# EAGLE schematic Great_Stroya (EAGLE 9.5.2)
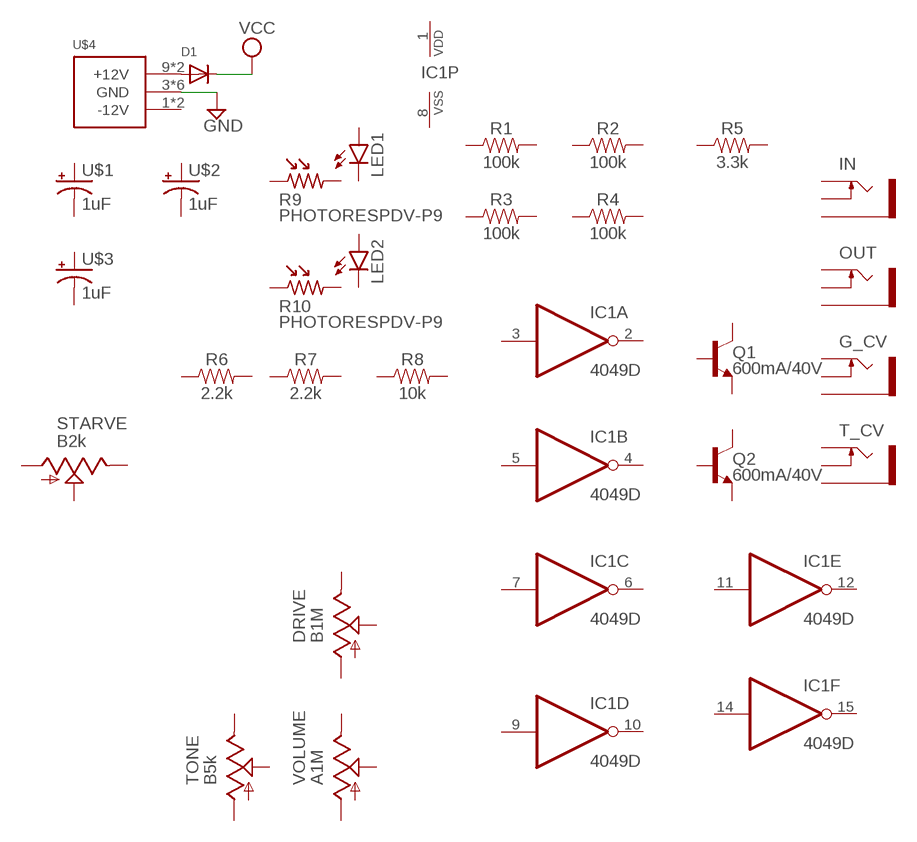
[diagram p0: schematic, sheet 1]

## Parts
D1  DIODESOD-123  [SOD-123]
DRIVE  B1M  9MM_SNAP-IN_POT_  [9MM_SNAP-IN_POT]
G_CV  THONKICONNNEW  [WQP-PJ301M-12_JACK]
IC1  4049D  [SO16]
IN  THONKICONNNEW  [WQP-PJ301M-12_JACK]
LED1  LED3MM  [LED3MM]
LED2  LED3MM  [LED3MM]
OUT  THONKICONNNEW  [WQP-PJ301M-12_JACK]
Q1  600mA/40V  TRANS_NPN-MMBT2222AL  [SOT23-3]
Q2  600mA/40V  TRANS_NPN-MMBT2222AL  [SOT23-3]
R1  100k  100KOHM-0603-1/10W-1%  [0603]
R2  100k  100KOHM-0603-1/10W-1%  [0603]
R3  100k  100KOHM-0603-1/10W-1%  [0603]
R4  100k  100KOHM-0603-1/10W-1%  [0603]
R5  3.3k  3.3KOHM-0603-1/10W-1%  [0603]
R6  2.2k  2.2KOHM-0603-1/10W-1%  [0603]
R7  2.2k  2.2KOHM-0603-1/10W-1%  [0603]
R8  10k  10KOHM-0603-1/10W-1%  [0603]
R9  PHOTORESPDV-P9  [PDV-P9XXX]
R10  PHOTORESPDV-P9  [PDV-P9XXX]
STARVE  B2k  9MM_SNAP-IN_POT_  [9MM_SNAP-IN_POT]
T_CV  THONKICONNNEW  [WQP-PJ301M-12_JACK]
TONE  B5k  9MM_SNAP-IN_POT_  [9MM_SNAP-IN_POT]
U$1  1uF  CAP_SMD+THRUPAN_B  [PAN_B_SMD+THRU]
U$2  1uF  CAP_SMD+THRUPAN_B  [PAN_B_SMD+THRU]
U$3  1uF  CAP_SMD+THRUPAN_B  [PAN_B_SMD+THRU]
U$4  POWER_SIMPLE10  [POWER_10]
VOLUME  A1M  9MM_SNAP-IN_POT_  [9MM_SNAP-IN_POT]

## Nets
GND: U$4.3(GND) U$4.4(GND) U$4.5(GND) U$4.6(GND) U$4.7(GND) U$4.8(GND)
N$1: D1.A U$4.9(+12V) U$4.10(+12V)
VCC: D1.C
Unconnected: DRIVE.1(A) DRIVE.2(S) DRIVE.3(E) G_CV.P$1_TIP(TIP) G_CV.P$2_SWITCH(SWITCH) G_CV.P$3_SLEEVE(SLEEVE) IC1.2(A:O) IC1.3(A:I) IC1.4(B:O) IC1.5(B:I) IC1.6(C:O) IC1.7(C:I) IC1.9(D:I) IC1.10(D:O) IC1.11(E:I) IC1.12(E:O) IC1.14(F:I) IC1.15(F:O) IN.P$1_TIP(TIP) IN.P$2_SWITCH(SWITCH) IN.P$3_SLEEVE(SLEEVE) LED1.A LED1.K(C) LED2.A LED2.K(C) OUT.P$1_TIP(TIP) OUT.P$2_SWITCH(SWITCH) OUT.P$3_SLEEVE(SLEEVE) Q1.1(B) Q1.2(E) Q1.3(C) Q2.1(B) Q2.2(E) Q2.3(C) R1.1 R1.2 R2.1 R2.2 R3.1 R3.2 R4.1 R4.2 R5.1 R5.2 R6.1 R6.2 R7.1 R7.2 R8.1 R8.2 R9.1 R9.2 R10.1 R10.2 STARVE.1(A) STARVE.2(S) STARVE.3(E) T_CV.P$1_TIP(TIP) T_CV.P$2_SWITCH(SWITCH) T_CV.P$3_SLEEVE(SLEEVE) TONE.1(A) TONE.2(S) TONE.3(E) U$1.+ U$1.++(+) U$1.- U$1.--(-) U$2.+ U$2.++(+) U$2.- U$2.--(-) U$3.+ U$3.++(+) U$3.- U$3.--(-) U$4.1(-12V) U$4.2(-12V) VOLUME.1(A) VOLUME.2(S) VOLUME.3(E)

## Power pins joined to a net without a drawn wire
VDD: IC1.1(P:VDD)
VSS: IC1.8(P:VSS)

## Library data of the parts
D1 = adafruit:DIODE: Diode SMADIODE - SMA Surface Mount Package 20V 1A Schottky Diode Digikey: 641-1014-6-ND DO-1N4148 - Through Hole Small Current Diode SOD-123 20V 1 A (.5mV Vf) Schottky Diode - Digikey: MBRX120TPMSCT-ND SOD-323 10V 570mA (.38mV Vf, 3ns) Schottky Diode - Digikey: ZLLS410CT-ND SOD-523 30V 30mA Schottky Diode (RB751S-40TE61) - Digikey: RB751S-40TE61CT-ND SOT23-R/W - SOT23 Package (R = Solder Paste/Reflow Ovens, W = Hand-Soldering) BAT54Film 40V 300mA - Digikey: 497-7162-1-ND
DRIVE STARVE TONE VOLUME = MusicThingModular:9MM_SNAP-IN_POT: 9mm vertical snap-in pot, Alpha / Panasonic style
G_CV IN OUT T_CV = MusicThingModular:THONKICONN: 3.5mm socket for Eurorack modular synths
IC1 = 40xx:4049: Hex inverting BUFFER
LED1 LED2 = led:LED: LED OSRAM: - CHIPLED LG R971, LG N971, LY N971, LG Q971, LY Q971, LO R971, LY R971 LH N974, LH R974 LS Q976, LO Q976, LY Q976 LO Q996 - Hyper CHIPLED LW Q18S LB Q993, LB Q99A, LB R99A - SideLED LS A670, LO A670, LY A670, LG A670, LP A670 LB A673, LV A673, LT A673, LW A673 LH A674 LY A675 LS A676, LA A676, LO A676, LY A676, LW A676 LS A679, LY A679, LG A679 - Hyper Micro SIDELED® LS Y876, LA Y876, LO Y876, LY Y876 LT Y87S - SmartLED LW L88C, LW L88S LB L89C, LB L89S, LG L890 LS L89K, LO L89K, LY L89K LS L896, LA L896, LO L896, LY L896 - TOPLED LS T670, LO T670, LY T670, LG T670, LP T670 LSG T670, LSP T670, LSY T670, LOP T670, LYG T670 LG T671, LOG T671, LSG T671 LB T673, LV T673, LT T673, LW T673 LH T674 LS T676, LA T676, LO T676, LY T676, LB T676, LH T676, LSB T676, LW T676 LB T67C, LV T67C, LT T67C, LS T67K, LO T67K, LY T67K, LW E67C LS E67B, LA E67B, LO E67B, LY E67B, LB E67C, LV E67C, LT E67C LW T67C LS T679, LY T679, LG T679 LS T770, LO T770, LY T770, LG T770, LP T770 LB T773, LV T773, LT T773, LW T773 LH T774 LS E675, LA E675, LY E675, LS T675 LS T776, LA T776, LO T776, LY T776, LB T776 LHGB T686 LT T68C, LB T68C - Hyper Mini TOPLED® LB M676 - Mini TOPLED Santana® LG M470 LS M47K, LO M47K, LY M47K Source: http://www.osram.convergy.de LUXEON: - LUMILED® LXK2-PW12-R00, LXK2-PW12-S00, LXK2-PW14-U00, LXK2-PW14-V00 LXK2-PM12-R00, LXK2-PM12-S00, LXK2-PM14-U00 LXK2-PE12-Q00, LXK2-PE12-R00, LXK2-PE12-S00, LXK2-PE14-T00, LXK2-PE14-U00 LXK2-PB12-K00, LXK2-PB12-L00, LXK2-PB12-M00, LXK2-PB14-N00, LXK2-PB14-P00, LXK2-PB14-Q00 LXK2-PR12-L00, LXK2-PR12-M00, LXK2-PR14-Q00, LXK2-PR14-R00 LXK2-PD12-Q00, LXK2-PD12-R00, LXK2-PD12-S00 LXK2-PH12-R00, LXK2-PH12-S00 LXK2-PL12-P00, LXK2-PL12-Q00, LXK2-PL12-R00 Source: www.luxeon.com KINGBRIGHT: KA-3528ASYC Source: www.kingbright.com
Q1 Q2 = SparkFun-DiscreteSemi:TRANS_NPN: NPN transistor Current controlled devices typically used to amplify current or used as a switch. BC547 - COM-08928 <http://www.sparkfun.com/products/8928> (TO-92 45V 100mA) (1.Collector 2.Base 3.Emitter) 2N3904 - COM-00521 <http://www.sparkfun.com/products/521> (TO-92 40V 200mA) (1.Emitter 2.Base 3.Collector) P2N2222A - COM-12852 <http://www.sparkfun.com/products/12852> (TO-92 40V 600mA) (1.Collector 2.Base 3.Emitter); PROD_ID: TRANS-08049
R1-R4 = SparkFun-Resistors:100KOHM: 100kΩ resistor A resistor is a passive two-terminal electrical component that implements electrical resistance as a circuit element. Resistors act to reduce current flow, and, at the same time, act to lower voltage levels within circuits. - Wikipedia; PROD_ID: RES-07828
R5 = SparkFun-Resistors:3.3KOHM: 3.3kΩ resistor A resistor is a passive two-terminal electrical component that implements electrical resistance as a circuit element. Resistors act to reduce current flow, and, at the same time, act to lower voltage levels within circuits. - Wikipedia; PROD_ID: RES-07851
R6 R7 = SparkFun-Resistors:2.2KOHM: 2.2kΩ resistor A resistor is a passive two-terminal electrical component that implements electrical resistance as a circuit element. Resistors act to reduce current flow, and, at the same time, act to lower voltage levels within circuits. - Wikipedia; PROD_ID: RES-08272
R8 = SparkFun-Resistors:10KOHM: 10kΩ resistor A resistor is a passive two-terminal electrical component that implements electrical resistance as a circuit element. Resistors act to reduce current flow, and, at the same time, act to lower voltage levels within circuits. - Wikipedia; PROD_ID: RES-00824
R9 R10 = ldr:PHOTORES: Photoresistor
U$1-U$3 = MusicThingModular:CAP_SMD+THRU
U$4 = eurorack:POWER_SIMPLE